# EAGLE schematic testes_portas_logicas (EAGLE 9.5.2)
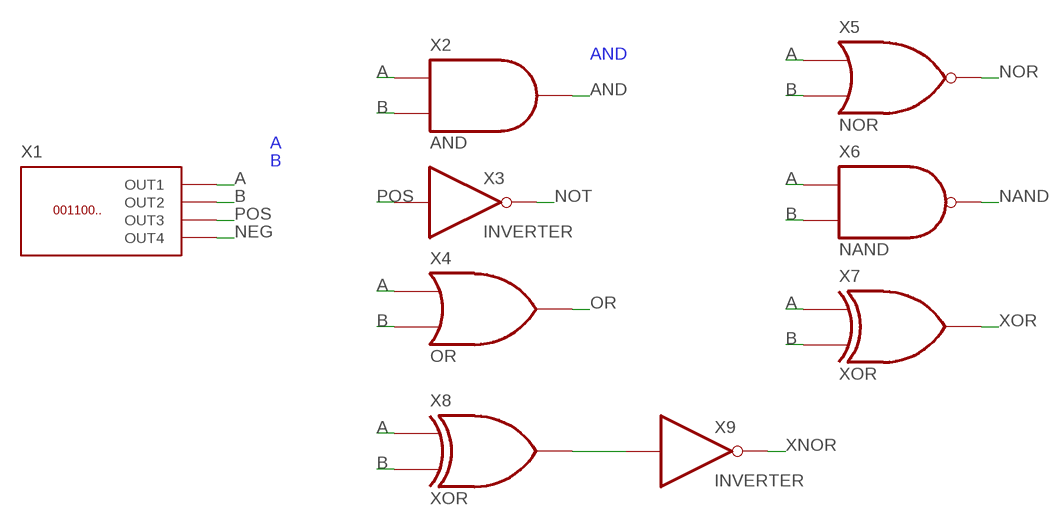
[diagram p0: schematic, sheet 1]

## Parts
X1  DIGSRC4  (no package)
X2  AND  (no package)
X3  INVERTER  (no package)
X4  OR  (no package)
X5  NOR  (no package)
X6  NAND  (no package)
X7  XOR  (no package)
X8  XOR  (no package)
X9  INVERTER  (no package)

## Nets
A: X1.OUT1 X2.A X4.A X5.A X6.A X7.A X8.A
AND: X2.Y
B: X1.OUT2 X2.B X4.B X5.B X6.B X7.B X8.B
N$3: X8.Y X9.I
NAND: X6.Y
NEG: X1.OUT4
NOR: X5.Y
NOT: X3.O
OR: X4.Y
POS: X1.OUT3 X3.I
XNOR: X9.O
XOR: X7.Y

## Library data of the parts
X1 = ngspice-digital:DIGSRC4: 4 output digital (file) source; EAGLE_DIGITAL_SOURCE_FILE: driverd4_1.dsource.txt; SPICEMODEL: DRIVERD4; SPICEPREFIX: X
X2 = ngspice-digital:AND: 2 input logic AND gate
X3 X9 = ngspice-digital:INVERTER: logic inverter (NOT gate)
X4 = ngspice-digital:OR: 2 input logic OR gate
X5 = ngspice-digital:NOR: 2 input NOR Gate
X6 = ngspice-digital:NAND: 2 input NAND gate
X7 X8 = ngspice-digital:XOR: 2 input XOR gate